# EAGLE design Controller2 (EAGLE 7.7.0)
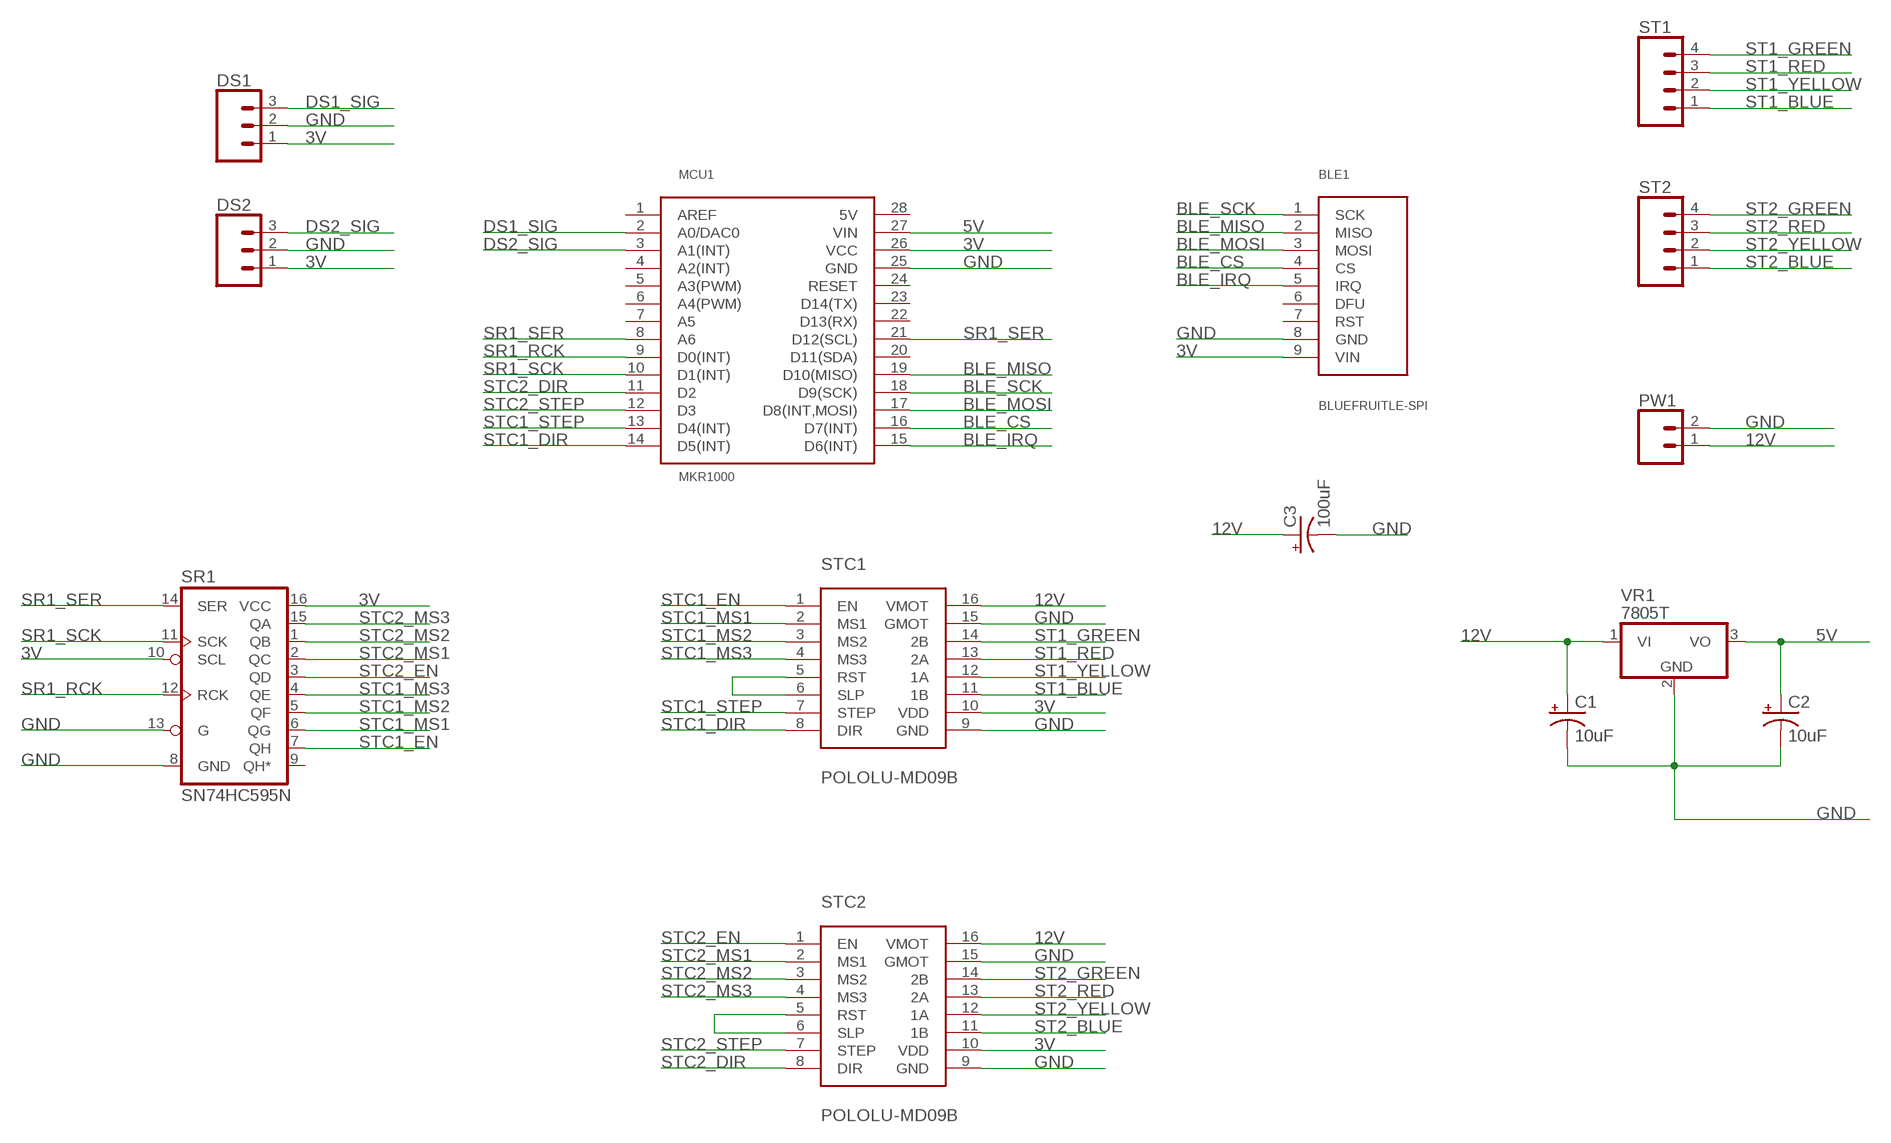
[diagram p0: schematic, sheet 1]

## Parts
BLE1  BLUEFRUITLE-SPI  [BLUEFRUITLE-SPI-SOCKET]
C1  10uF  CPOL-USE2-5  [E2-5]
C2  10uF  CPOL-USE2-5  [E2-5]
C3  100uF  CPOL-USE2-5  [E2-5]
DS1  CONN_03LONGPADS  [1X03_LONGPADS]
DS2  CONN_03LONGPADS  [1X03_LONGPADS]
MCU1  MKR1000  [MKR1000-SOCKET]
PW1  CONN_025MM  [SCREWTERMINAL-5MM-2]
SR1  SN74HC595N  74HC595N  [DIP16]
ST1  CONN_04LONGPADS  [1X04_LONGPADS]
ST2  CONN_04LONGPADS  [1X04_LONGPADS]
STC1  POLOLU-MD09B  [POLOLU-MD09B]
STC2  POLOLU-MD09B  [POLOLU-MD09B]
VR1  7805T  [TO220H]

## Nets
3V: BLE1.9(VIN) DS1.1 DS2.1 MCU1.26(VCC) SR1.10(SCL) SR1.16(VCC) STC1.10(VDD) STC2.10(VDD)
5V: C2.+ MCU1.27(VIN) VR1.3(VO)
12V: C1.+ C3.+ PW1.1 STC1.16(VMOT) STC2.16(VMOT) VR1.1(VI)
BLE_CS: BLE1.4(CS) MCU1.16(D7(INT))
BLE_IRQ: BLE1.5(IRQ) MCU1.15(D6(INT))
BLE_MISO: BLE1.2(MISO) MCU1.19(D10(MISO))
BLE_MOSI: BLE1.3(MOSI) MCU1.17(D8(INT,MOSI))
BLE_SCK: BLE1.1(SCK) MCU1.18(D9(SCK))
DS1_SIG: DS1.3 MCU1.2(A0/DAC0)
DS2_SIG: DS2.3 MCU1.3(A1(INT))
GND: BLE1.8(GND) C1.- C2.- C3.- DS1.2 DS2.2 MCU1.25(GND) PW1.2 SR1.8(GND) SR1.13(G) STC1.9(GND) STC1.15(GMOT) STC2.9(GND) STC2.15(GMOT) VR1.2(GND)
N$1: STC1.5(RST) STC1.6(SLP)
N$6: STC2.5(RST) STC2.6(SLP)
SR1_RCK: MCU1.9(D0(INT)) SR1.12(RCK)
SR1_SCK: MCU1.10(D1(INT)) SR1.11(SCK)
SR1_SER: MCU1.8(A6) MCU1.21(D12(SCL)) SR1.14(SER)
ST1_BLUE: ST1.1 STC1.11(1B)
ST1_GREEN: ST1.4 STC1.14(2B)
ST1_RED: ST1.3 STC1.13(2A)
ST1_YELLOW: ST1.2 STC1.12(1A)
ST2_BLUE: ST2.1 STC2.11(1B)
ST2_GREEN: ST2.4 STC2.14(2B)
ST2_RED: ST2.3 STC2.13(2A)
ST2_YELLOW: ST2.2 STC2.12(1A)
STC1_DIR: MCU1.14(D5(INT)) STC1.8(DIR)
STC1_EN: SR1.7(QH) STC1.1(EN)
STC1_MS1: SR1.6(QG) STC1.2(MS1)
STC1_MS2: SR1.5(QF) STC1.3(MS2)
STC1_MS3: SR1.4(QE) STC1.4(MS3)
STC1_STEP: MCU1.13(D4(INT)) STC1.7(STEP)
STC2_DIR: MCU1.11(D2) STC2.8(DIR)
STC2_EN: SR1.3(QD) STC2.1(EN)
STC2_MS1: SR1.2(QC) STC2.2(MS1)
STC2_MS2: SR1.1(QB) STC2.3(MS2)
STC2_MS3: SR1.15(QA) STC2.4(MS3)
STC2_STEP: MCU1.12(D3) STC2.7(STEP)
Unconnected: BLE1.6(DFU) BLE1.7(RST) MCU1.1(AREF) MCU1.4(A2(INT)) MCU1.5(A3(PWM)) MCU1.6(A4(PWM)) MCU1.7(A5) MCU1.20(D11(SDA)) MCU1.22(D13(RX)) MCU1.23(D14(TX)) MCU1.24(RESET) MCU1.28(5V) SR1.9(QH*)

## Library data of the parts
BLE1 = Library:BLUEFRUITLE-SPI: Adafruit Bluefruit LE SPI Friend.
C1-C3 = adafruit:CPOL-US: POLARIZED CAPACITOR, American symbol
DS1 DS2 = SparkFun-Connectors:CONN_03: Multi connection point. Often used as Generic Header-pin footprint for 0.1 inch spaced/style header connections On any of the 0.1 inch spaced packages, you can populate with these: Break Away Headers - Straight <https://www.sparkfun.com/products/116> (PRT-00116) Break Away Male Headers - Right Angle <https://www.sparkfun.com/products/553> (PRT-00553) Female Headers <https://www.sparkfun.com/products/115> (PRT-00115) Break Away Headers - Machine Pin <https://www.sparkfun.com/products/117> (PRT-00117) Break Away Female Headers - Swiss Machine Pin <https://www.sparkfun.com/products/743> (PRT-00743) Stackable Header - 3 Pin (Female, 0.1") <https://www.sparkfun.com/products/13875> (PRT-13875) For SCREWTERMINALS and SPRING TERMINALS visit here: Screw Terimnals on SparkFun.com <https://www.sparkfun.com/search/results?term=Screw+Terminals> (5mm/3.5mm/2.54mm spacing) This device is also useful as a general connection point to wire up your design to another part of your project. Our various solder wires solder well into these plated through hole pads. Hook-Up Wire - Assortment (Stranded, 22 AWG) <https://www.sparkfun.com/products/11375> (PRT-11375) Hook-Up Wire - Assortment (Solid Core, 22 AWG) <https://www.sparkfun.com/products/11367> (PRT-11367) View the entire wire category on our website here <https://www.sparkfun.com/categories/141> Special notes: Molex polarized connector foot print use with SKU : PRT-08232 with associated crimp pins and housings.
MCU1 = Library:MKR1000: The Arduino MKR1000.
PW1 = SparkFun-Connectors:CONN_02: Multi connection point. Often used as Generic Header-pin footprint for 0.1 inch spaced/style header connections On any of the 0.1 inch spaced packages, you can populate with these: Break Away Headers - Straight <https://www.sparkfun.com/products/116> (PRT-00116) Break Away Male Headers - Right Angle <https://www.sparkfun.com/products/553> (PRT-00553) Female Headers <https://www.sparkfun.com/products/115> (PRT-00115) Break Away Headers - Machine Pin <https://www.sparkfun.com/products/117> (PRT-00117) Break Away Female Headers - Swiss Machine Pin <https://www.sparkfun.com/products/743> (PRT-00743) For SCREWTERMINALS and SPRING TERMINALS visit here: Screw Terimnals on SparkFun.com <https://www.sparkfun.com/search/results?term=Screw+Terminals> (5mm/3.5mm/2.54mm spacing) This device is also useful as a general connection point to wire up your design to another part of your project. Our various solder wires solder well into these plated through hole pads. Hook-Up Wire - Assortment (Stranded, 22 AWG) <https://www.sparkfun.com/products/11375> (PRT-11375) Hook-Up Wire - Assortment (Solid Core, 22 AWG) <https://www.sparkfun.com/products/11367> (PRT-11367) View the entire wire category on our website here <https://www.sparkfun.com/categories/141> Special notes: Molex polarized connector foot print use with: PRT-08233 with associated crimp pins and housings. 2.54_SCREWTERM for use with PRT-10571. 3.5mm Screw Terminal footprints for PRT-08084 5mm Screw Terminal footprints for use with PRT-08432; SF_SKU: PRT-08432
SR1 = SparkFun-IC-Logic:74*595: 8-Bit Shift Register (Serial to Parallel) Datasheet <http://cdn.sparkfun.com/datasheets/BreakoutBoards/MM74HC595.pdf> SparkFun Products SparkFun Shift Register Breakout - 74HC595 <https://www.sparkfun.com/products/10680> (BOB-10680); PROD_ID: IC-13123
ST1 ST2 = SparkFun-Connectors:CONN_04: Multi connection point. Often used as Generic Header-pin footprint for 0.1 inch spaced/style header connections On any of the 0.1 inch spaced packages, you can populate with these: Break Away Headers - Straight <https://www.sparkfun.com/products/116> (PRT-00116) Break Away Male Headers - Right Angle <https://www.sparkfun.com/products/553> (PRT-00553) Female Headers <https://www.sparkfun.com/products/115> (PRT-00115) Break Away Headers - Machine Pin <https://www.sparkfun.com/products/117> (PRT-00117) Break Away Female Headers - Swiss Machine Pin <https://www.sparkfun.com/products/743> (PRT-00743) For SCREWTERMINALS and SPRING TERMINALS visit here: Screw Terimnals on SparkFun.com <https://www.sparkfun.com/search/results?term=Screw+Terminals> (5mm/3.5mm/2.54mm spacing) This device is also useful as a general connection point to wire up your design to another part of your project. Our various solder wires solder well into these plated through hole pads. Hook-Up Wire - Assortment (Stranded, 22 AWG) <https://www.sparkfun.com/products/11375> (PRT-11375) Hook-Up Wire - Assortment (Solid Core, 22 AWG) <https://www.sparkfun.com/products/11367> (PRT-11367) View the entire wire category on our website here <https://www.sparkfun.com/categories/141> Special notes: Molex polarized connector foot print use with SKU : PRT-08231 with associated crimp pins and housings. 1MM SMD Version SKU: PRT-10208; PROD_ID: CONN-09696
STC1 STC2 = Library:POLOLU-MD09B: The Pololu MD09B stepper controller.
VR1 = adafruit:78*: Positive VOLTAGE REGULATOR Added bigger pads to the TO-92 package

## Board
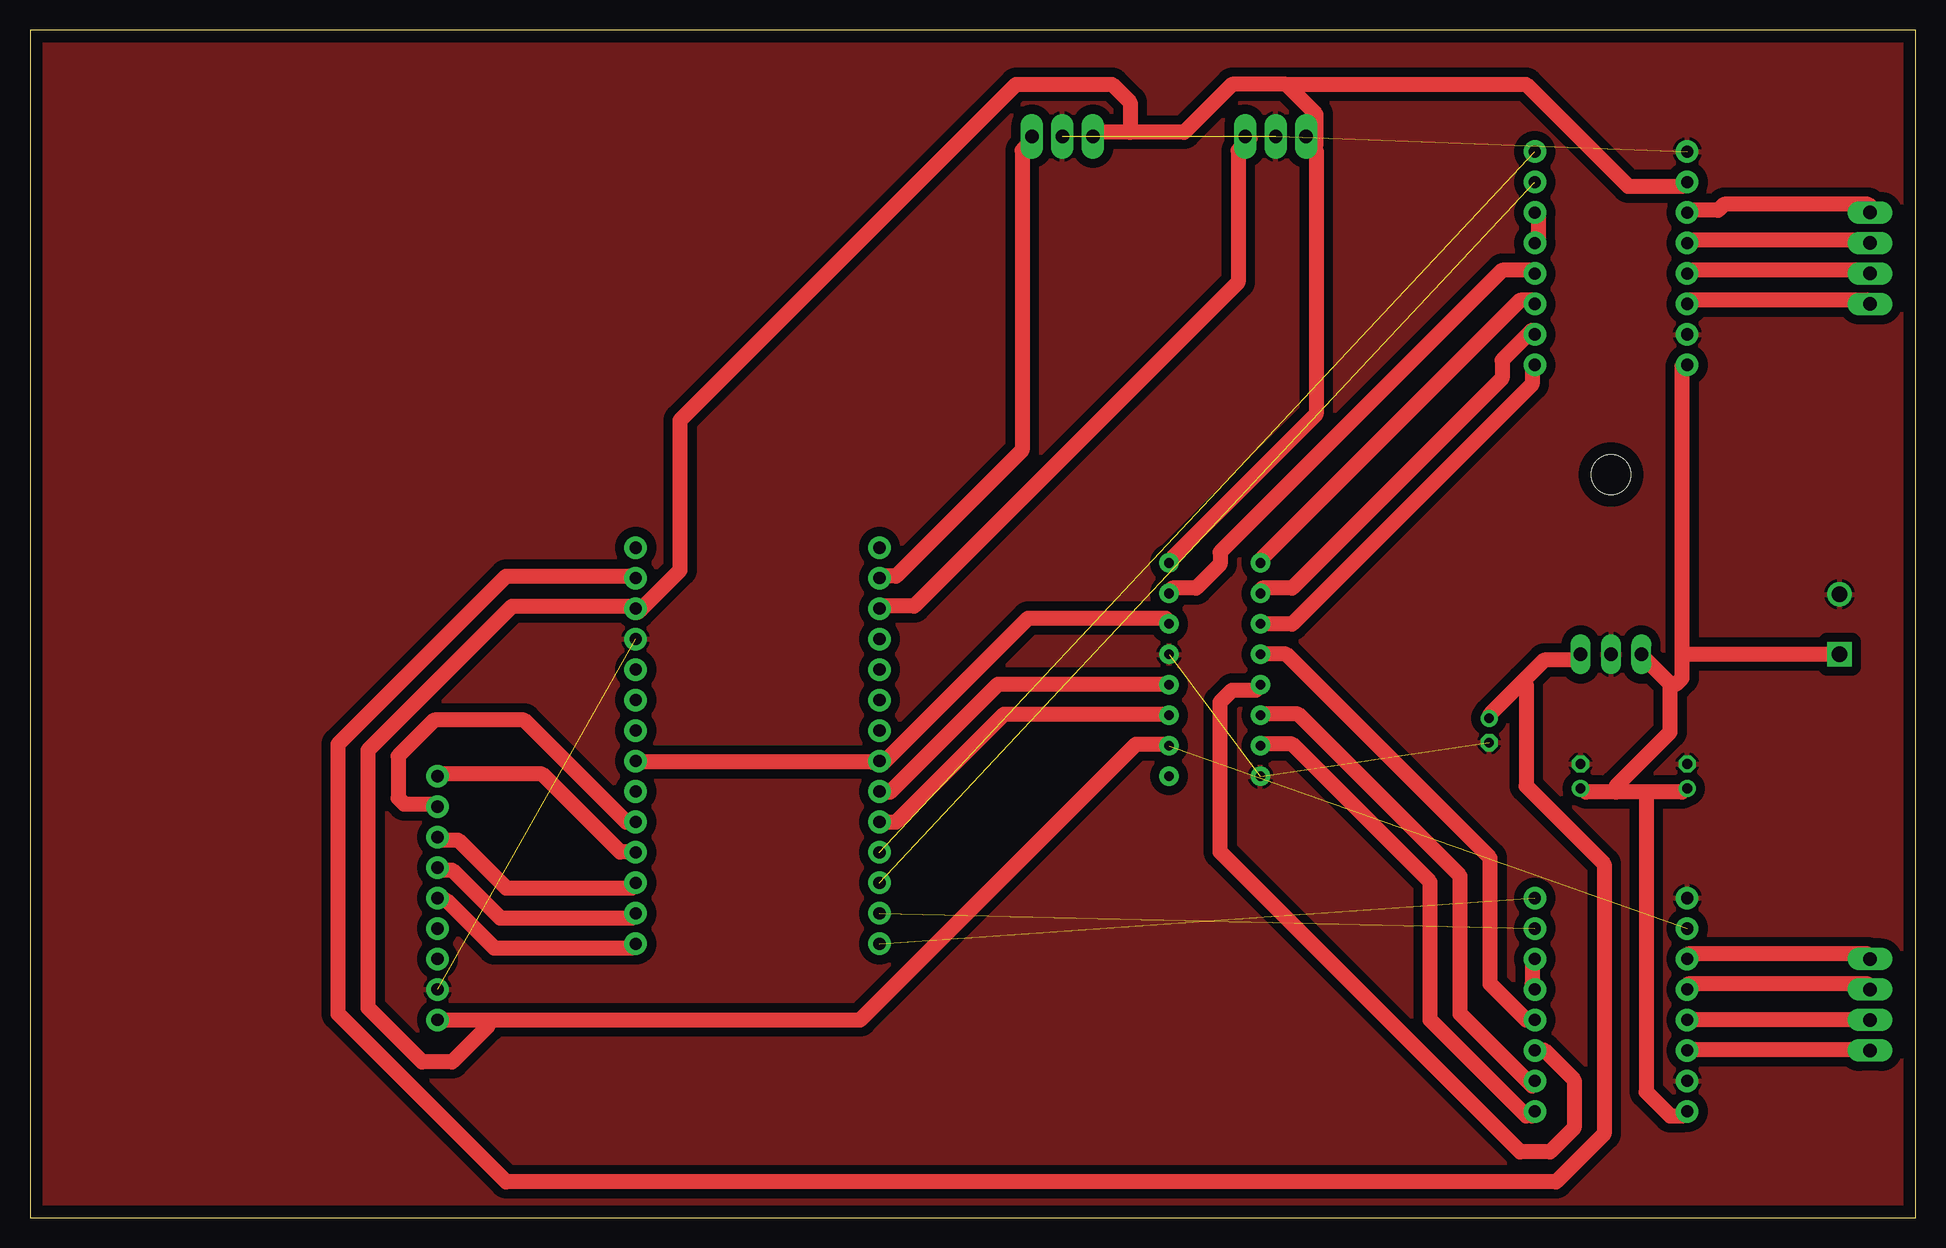
[diagram p1: board, top side]
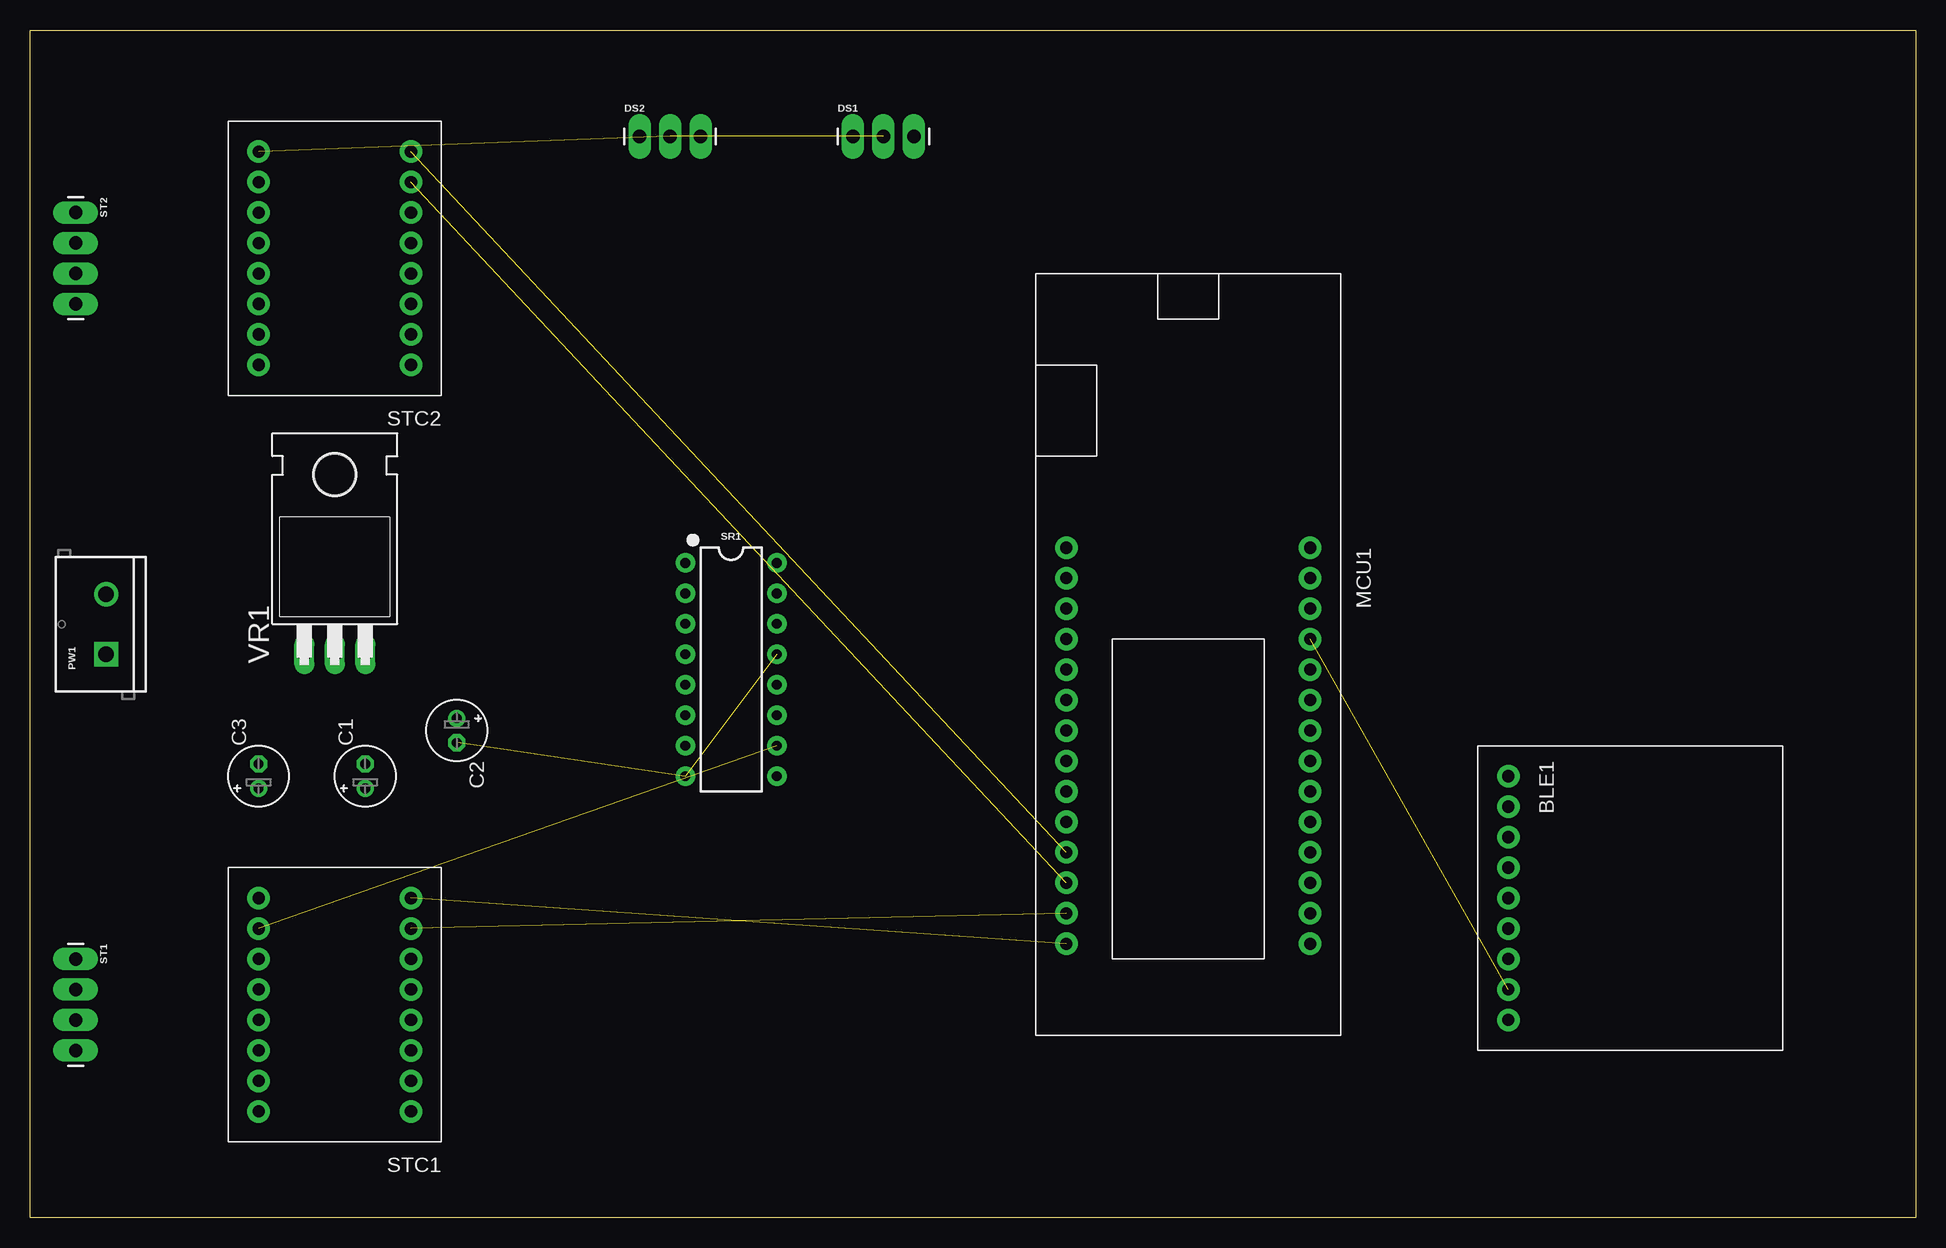
[diagram p2: board, bottom side, seen from below]

Size 157.15 x 99.04 mm. Coordinates in mm from the lower left corner, seen from the top.
Outline: 157.15,0 157.15,99.04 0,99.04 0,0 157.15,0
Copper layers (1*16): Top 0.035mm / dielectric 1.5mm / Bottom 0.035mm
Design rules "default *": minimum track width 50mil, minimum drill 24mil, track to track 30mil, track to pad 20mil, pad to pad 20mil, via to via 20mil, smd to smd 20mil, copper to edge 40mil, drill to drill 8mil, minimum pad ring 10mil, minimum via ring 8mil, stop-mask expansion 4mil, vias tented up to drill 0mil, thermal gap 10mil

### Footprints (pad centres in the part's own frame; a part is rotated, then mirrored left to right if it is on the bottom)
BLUEFRUITLE-SPI-SOCKET = drill 1.016 pad 1.88: 1 -10.16,0; 2 -7.62,0; 3 -5.08,0; 4 -2.54,0; 5 0,0; 6 2.54,0; 7 5.08,0; 8 7.62,0; 9 10.16,0
E2-5 = drill 0.813 pad 1.422: + -1.016,0 | drill 0.813 pad 1.422 octagon: - 1.016,0
1X03_LONGPADS = drill 1.118 pad 1.88 long: 1 0,0; 2 2.54,0; 3 5.08,0
MKR1000-SOCKET = drill 1.016 pad 1.88: 1 -16.51,-10.16; 2 -13.97,-10.16; 3 -11.43,-10.16; 4 -8.89,-10.16; 5 -6.35,-10.16; 6 -3.81,-10.16; 7 -1.27,-10.16; 8 1.27,-10.16; 9 3.81,-10.16; 10 6.35,-10.16; 11 8.89,-10.16; 12 11.43,-10.16; 13 13.97,-10.16; 14 16.51,-10.16; 15 16.51,10.16; 16 13.97,10.16; 17 11.43,10.16; 18 8.89,10.16; 19 6.35,10.16; 20 3.81,10.16; 21 1.27,10.16; 22 -1.27,10.16; 23 -3.81,10.16; 24 -6.35,10.16; 25 -8.89,10.16; 26 -11.43,10.16; 27 -13.97,10.16; 28 -16.51,10.16
SCREWTERMINAL-5MM-2 = drill 1.3 pad 2.032 square: 1 0,0 | drill 1.3 pad 2.032: 2 5,0
DIP16 = drill 0.813 pad 1.626: 1 -8.89,-3.81; 2 -6.35,-3.81; 3 -3.81,-3.81; 4 -1.27,-3.81; 5 1.27,-3.81; 6 3.81,-3.81; 7 6.35,-3.81; 8 8.89,-3.81; 9 8.89,3.81; 10 6.35,3.81; 11 3.81,3.81; 12 1.27,3.81; 13 -1.27,3.81; 14 -3.81,3.81; 15 -6.35,3.81; 16 -8.89,3.81
1X04_LONGPADS = drill 1.118 pad 1.88 long: 1 0,0; 2 2.54,0; 3 5.08,0; 4 7.62,0
POLOLU-MD09B = drill 1.016 pad 1.88: 1 -6.35,8.89; 2 -6.35,6.35; 3 -6.35,3.81; 4 -6.35,1.27; 5 -6.35,-1.27; 6 -6.35,-3.81; 7 -6.35,-6.35; 8 -6.35,-8.89; 9 6.35,-8.89; 10 6.35,-6.35; 11 6.35,-3.81; 12 6.35,-1.27; 13 6.35,1.27; 14 6.35,3.81; 15 6.35,6.35; 16 6.35,8.89
TO220H = drill 1.118 long: 1 -2.54,-10.16; 2 0,-10.16; 3 2.54,-10.16 | hole 3.302: 0,4.826

### Placement (x,y rotation side)
BLE1  33.96,26.67 270 bottom
C1  129.21,36.83 90 bottom
C2  121.59,40.64 270 bottom
C3  138.1,36.83 90 bottom
DS1  88.57,90.17 0 bottom
DS2  106.35,90.17 0 bottom
MCU1  60.63,39.37 270 bottom
PW1  150.8,46.99 90 bottom
SR1  98.73,45.72 270 bottom
ST1  153.34,21.59 270 bottom
ST2  153.34,83.82 270 bottom
STC1  131.75,17.78 180 bottom
STC2  131.75,80.01 180 bottom
VR1  131.75,57.15 0 bottom

### Tracks (layer width: path | path; a pad name or v marks a point on that pad's centre or on a via)
3V  (1 unrouted)
  Top 1.27: SR1.16 95.17,55 107.17,67 107.17,89 106.17,90 DS2.1 107.17,89.5 107.17,92 104.67,94.5 | 91.67,90.5 96.17,90.5 100.17,94.5 104.67,94.5 | 91.67,90.5 88.67,90.5 DS1.1 | 104.67,94.5 124.67,94.5 133.17,86 137.67,86 STC2.10 | 38.17,16.5 34.17,16.5 BLE1.9 | 38.17,16.5 69.17,16.5 92.17,39.5 94.67,39.5 SR1.10 | 38.17,16.5 38.17,16 35.17,13 32.67,13 28.17,17.5 28.17,39 40.17,51 50.17,51 MCU1.26 50.67,50.5 54.17,54 54.17,66.5 82.17,94.5 90.17,94.5 91.67,93 91.67,90.5
5V
  Top 1.27: 124.42,44.75 126.17,46.5 129.17,46.5 VR1.3 | 124.42,44.75 121.67,42 C2.+ | MCU1.27 50.17,53.5 39.67,53.5 25.67,39.5 25.67,17 39.67,3 127.17,3 131.17,7 131.17,29.5 124.67,36 124.67,44.5 124.42,44.75
12V
  Top 1.27: 134.67,35.5 137.67,35.5 C3.+ | 134.67,35.5 132.17,35.5 | 132.17,35.5 129.67,35.5 C1.+ | 136.67,44.5 134.67,46.5 VR1.1 | 136.67,44.5 136.67,40.5 132.17,36 132.17,35.5 | 134.67,35.5 134.67,10.5 136.67,8.5 137.67,8.5 STC1.16 | 137.67,47 137.67,45 137.17,44.5 136.67,44.5 | 137.67,47 137.67,71 STC2.16 | 137.67,47 150.67,47 PW1.1
BLE_CS
  Top 1.27: MCU1.16 50.17,25 39.17,25 35.17,29 34.17,29 BLE1.4
BLE_IRQ
  Top 1.27: MCU1.15 50.17,22.5 38.67,22.5 34.67,26.5 34.17,26.5 BLE1.5
BLE_MISO
  Top 1.27: BLE1.2 33.67,34.5 31.17,34.5 30.67,35 30.67,38.5 33.67,41.5 41.17,41.5 49.67,33 50.17,33 MCU1.19
BLE_MOSI
  Top 1.27: MCU1.17 50.17,27.5 39.67,27.5 35.67,31.5 34.17,31.5 BLE1.3
BLE_SCK
  Top 1.27: BLE1.1 34.17,37 42.67,37 49.17,30.5 50.17,30.5 MCU1.18
DS1_SIG
  Top 1.27: MCU1.2 71.17,53.5 72.17,53.5 82.67,64 82.67,89 83.67,90 DS1.3
DS2_SIG
  Top 1.27: MCU1.3 71.17,51 73.67,51 100.67,78 100.67,89 101.67,90 DS2.3
GND  (5 unrouted)
  pour Top: -0.33,0 -0.33,99.06 157.15,99.06 157.15,0
N$1
  Top 1.27: STC1.5 125.17,19.5 125.17,21.5 STC1.6
N$6
  Top 1.27: STC2.5 125.67,81.5 125.67,83.5 STC2.6
SR1_RCK
  Top 1.27: SR1.12 94.67,44.5 80.67,44.5 71.67,35.5 71.17,35.5 MCU1.9
SR1_SCK
  Top 1.27: SR1.11 94.67,42 81.17,42 72.17,33 71.17,33 MCU1.10
SR1_SER
  Top 1.27: SR1.14 94.67,50 83.17,50 71.17,38 MCU1.8 70.17,38 50.67,38 MCU1.21
ST1_BLUE
  Top 1.27: STC1.11 138.17,22 153.17,22 ST1.1
ST1_GREEN
  Top 1.27: STC1.14 138.17,14 153.17,14 ST1.4
ST1_RED
  Top 1.27: STC1.13 138.17,16.5 153.17,16.5 ST1.3
ST1_YELLOW
  Top 1.27: STC1.12 138.17,19.5 153.17,19.5 ST1.2
ST2_BLUE
  Top 1.27: STC2.11 138.17,84 140.67,84 141.17,84.5 153.17,84.5 153.67,84 ST2.1
ST2_GREEN
  Top 1.27: STC2.14 138.17,76.5 153.17,76.5 ST2.4
ST2_RED
  Top 1.27: STC2.13 138.17,79 153.17,79 ST2.3
ST2_YELLOW
  Top 1.27: STC2.12 138.17,81.5 153.17,81.5 ST2.2
STC1_DIR  (1 unrouted)
STC1_EN
  Top 1.27: SR1.7 102.67,39.5 105.17,39.5 116.67,28 116.67,16.5 124.67,8.5 125.17,8.5 STC1.1
STC1_MS1
  Top 1.27: SR1.6 102.67,42 105.67,42 119.17,28.5 119.17,17 125.17,11 STC1.2
STC1_MS2
  Top 1.27: SR1.5 102.17,44 100.17,44 99.17,43 99.17,30.5 124.17,5.5 126.67,5.5 128.67,7.5 128.67,11.5 126.17,14 125.67,14 STC1.3
STC1_MS3
  Top 1.27: SR1.4 102.67,47 104.67,47 121.67,30 121.67,19.5 124.67,16.5 125.17,16.5 STC1.4
STC1_STEP  (1 unrouted)
STC2_DIR  (1 unrouted)
STC2_EN
  Top 1.27: SR1.3 102.67,49.5 105.17,49.5 125.17,69.5 125.17,71 STC2.1
STC2_MS1
  Top 1.27: SR1.2 102.67,52.5 105.17,52.5 122.67,70 122.67,71.5 125.17,74 STC2.2
STC2_MS2
  Top 1.27: SR1.1 102.67,55 124.17,76.5 125.17,76.5 STC2.3
STC2_MS3
  Top 1.27: SR1.15 95.17,52.5 97.17,52.5 99.17,54.5 99.17,55.5 122.67,79 125.17,79 STC2.4
STC2_STEP  (1 unrouted)